# Altium schematic sheet IO Systems.SchDoc: INPUT / OUTPUT SYSTEMS
size A2; DrawnBy: Avishka Herath; DocumentNumber: 1; Revision: 1.4; SheetNumber: 1; SheetTotal: 2; Project: Coco V2.0 PCB
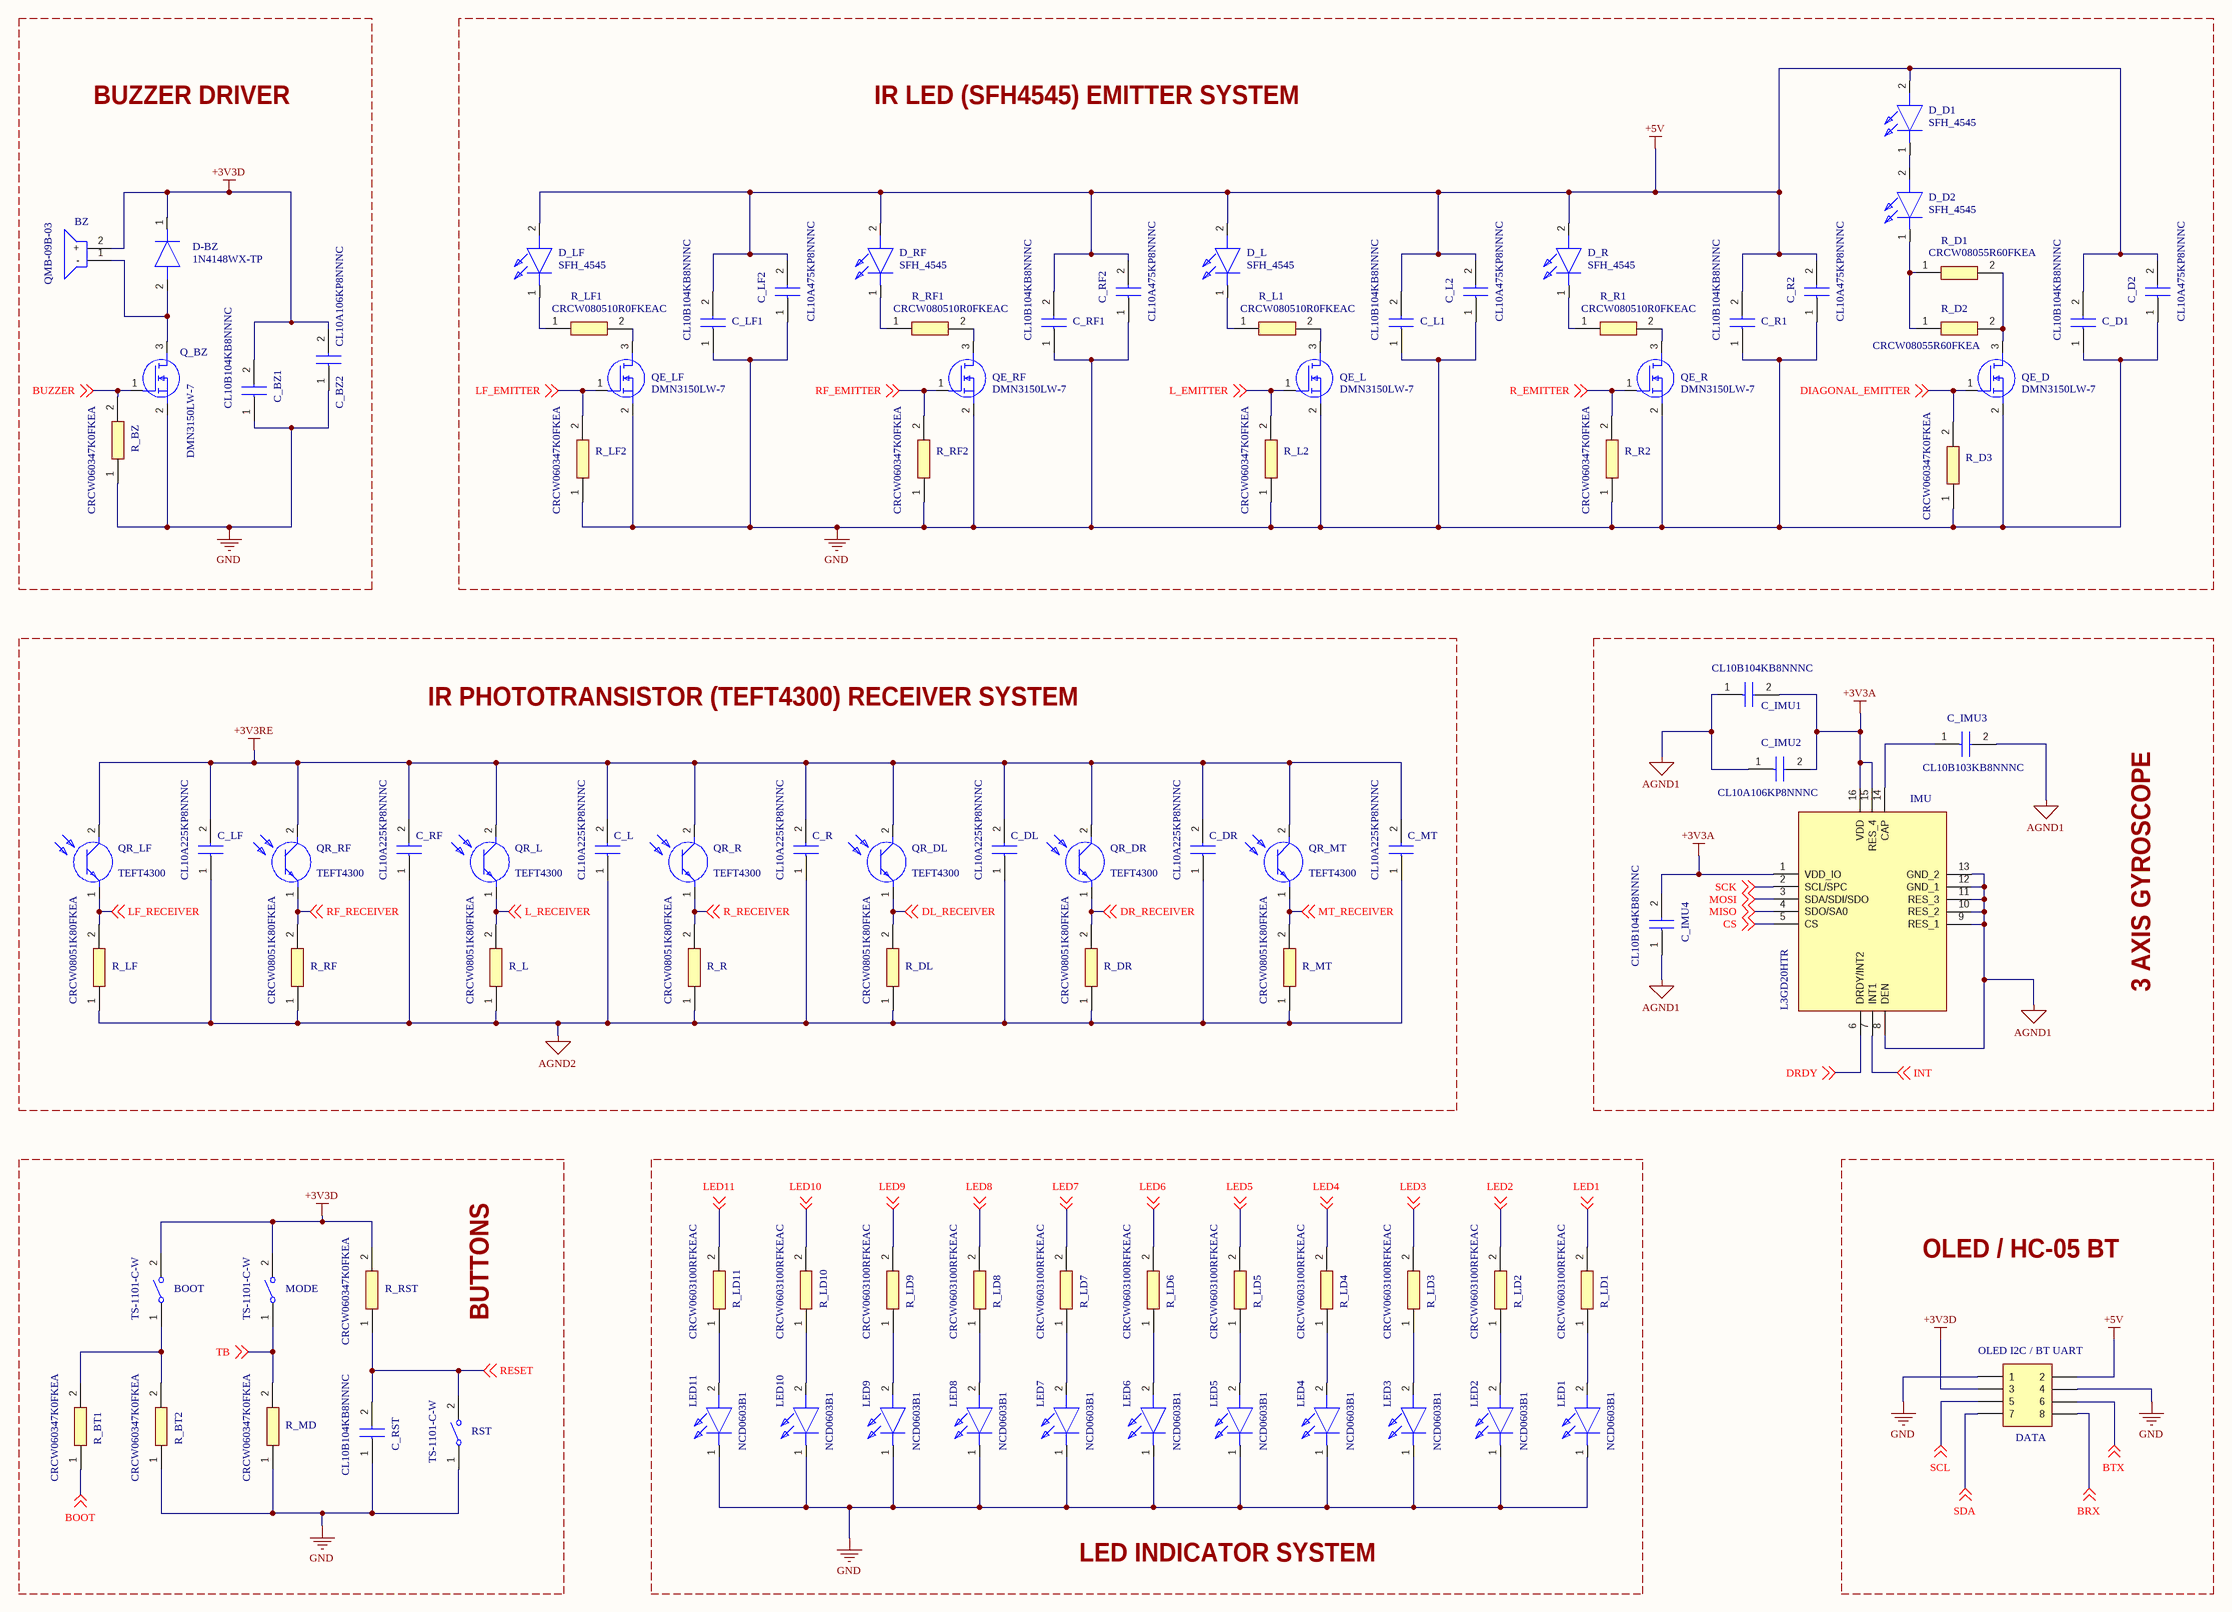
[diagram p0: IO Systems.SchDoc]

## Parts
BOOT  TS-1101-C-W  [TECO-FSMSM-2_V]
BZ  QMB-09B-03  [CST931AP]
C_BZ1  CL10B104KB8NNNC  [CAPC1608X90N]
C_BZ2  CL10A106KP8NNNC  [CAPC1608X90N]
C_D1  CL10B104KB8NNNC  [CAPC1608X90N]
C_D2  CL10A475KP8NNNC  [CAPC1608X90N]
C_DL  CL10A225KP8NNNC  [CAPC1608X90N]
C_DR  CL10A225KP8NNNC  [CAPC1608X90N]
C_IMU1  CL10B104KB8NNNC  [CAPC1608X90N]
C_IMU2  CL10A106KP8NNNC  [CAPC1608X90N]
C_IMU3  CL10B103KB8NNNC  [CAPC1608X90N]
C_IMU4  CL10B104KB8NNNC  [CAPC1608X90N]
C_L  CL10A225KP8NNNC  [CAPC1608X90N]
C_L1  CL10B104KB8NNNC  [CAPC1608X90N]
C_L2  CL10A475KP8NNNC  [CAPC1608X90N]
C_LF  CL10A225KP8NNNC  [CAPC1608X90N]
C_LF1  CL10B104KB8NNNC  [CAPC1608X90N]
C_LF2  CL10A475KP8NNNC  [CAPC1608X90N]
C_MT  CL10A225KP8NNNC  [CAPC1608X90N]
C_R  CL10A225KP8NNNC  [CAPC1608X90N]
C_R1  CL10B104KB8NNNC  [CAPC1608X90N]
C_R2  CL10A475KP8NNNC  [CAPC1608X90N]
C_RF  CL10A225KP8NNNC  [CAPC1608X90N]
C_RF1  CL10B104KB8NNNC  [CAPC1608X90N]
C_RF2  CL10A475KP8NNNC  [CAPC1608X90N]
C_RST  CL10B104KB8NNNC  [CAPC1608X90N]
D-BZ  1N4148WX-TP  [SOD2512X115N]
D_D1  SFH_4545  [SFH4545]
D_D2  SFH_4545  [SFH4545]
D_L  SFH_4545  [SFH4545]
D_LF  SFH_4545  [SFH4545]
D_R  SFH_4545  [SFH4545]
D_RF  SFH_4545  [SFH4545]
DATA  OLED I2C / BT UART  [MY_FE04-2]
IMU  L3GD20HTR  [H3LIS100DLTR]
LED1  NCD0603B1  [LEDC1608X40N]
LED2  NCD0603B1  [LEDC1608X40N]
LED3  NCD0603B1  [LEDC1608X40N]
LED4  NCD0603B1  [LEDC1608X40N]
LED5  NCD0603B1  [LEDC1608X40N]
LED6  NCD0603B1  [LEDC1608X40N]
LED7  NCD0603B1  [LEDC1608X40N]
LED8  NCD0603B1  [LEDC1608X40N]
LED9  NCD0603B1  [LEDC1608X40N]
LED10  NCD0603B1  [LEDC1608X40N]
LED11  NCD0603B1  [LEDC1608X40N]
MODE  TS-1101-C-W  [TECO-FSMSM-2_V]
Q_BZ  DMN3150LW-7  [SOT65P210X110-3N]
QE_D  DMN3150LW-7  [SOT65P210X110-3N]
QE_L  DMN3150LW-7  [SOT65P210X110-3N]
QE_LF  DMN3150LW-7  [SOT65P210X110-3N]
QE_R  DMN3150LW-7  [SOT65P210X110-3N]
QE_RF  DMN3150LW-7  [SOT65P210X110-3N]
QR_DL  TEFT4300  [TEFT4300]
QR_DR  TEFT4300  [TEFT4300]
QR_L  TEFT4300  [TEFT4300]
QR_LF  TEFT4300  [TEFT4300]
QR_MT  TEFT4300  [TEFT4300]
QR_R  TEFT4300  [TEFT4300]
QR_RF  TEFT4300  [TEFT4300]
R_BT1  CRCW060347K0FKEA  [RESC1608X50N]
R_BT2  CRCW060347K0FKEA  [RESC1608X50N]
R_BZ  CRCW060347K0FKEA  [RESC1608X50N]
R_D1  CRCW08055R60FKEA  [RESC2012X60N]
R_D2  CRCW08055R60FKEA  [RESC2012X60N]
R_D3  CRCW060347K0FKEA  [RESC1608X50N]
R_DL  CRCW08051K80FKEA  [RESC2012X60N]
R_DR  CRCW08051K80FKEA  [RESC2012X60N]
R_L  CRCW08051K80FKEA  [RESC2012X60N]
R_L1  CRCW080510R0FKEAC  [RESC2012X60N]
R_L2  CRCW060347K0FKEA  [RESC1608X50N]
R_LD1  CRCW0603100RFKEAC  [RESC1608X55N]
R_LD2  CRCW0603100RFKEAC  [RESC1608X55N]
R_LD3  CRCW0603100RFKEAC  [RESC1608X55N]
R_LD4  CRCW0603100RFKEAC  [RESC1608X55N]
R_LD5  CRCW0603100RFKEAC  [RESC1608X55N]
R_LD6  CRCW0603100RFKEAC  [RESC1608X55N]
R_LD7  CRCW0603100RFKEAC  [RESC1608X55N]
R_LD8  CRCW0603100RFKEAC  [RESC1608X55N]
R_LD9  CRCW0603100RFKEAC  [RESC1608X55N]
R_LD10  CRCW0603100RFKEAC  [RESC1608X55N]
R_LD11  CRCW0603100RFKEAC  [RESC1608X55N]
R_LF  CRCW08051K80FKEA  [RESC2012X60N]
R_LF1  CRCW080510R0FKEAC  [RESC2012X60N]
R_LF2  CRCW060347K0FKEA  [RESC1608X50N]
R_MD  CRCW060347K0FKEA  [RESC1608X50N]
R_MT  CRCW08051K80FKEA  [RESC2012X60N]
R_R  CRCW08051K80FKEA  [RESC2012X60N]
R_R1  CRCW080510R0FKEAC  [RESC2012X60N]
R_R2  CRCW060347K0FKEA  [RESC1608X50N]
R_RF  CRCW08051K80FKEA  [RESC2012X60N]
R_RF1  CRCW080510R0FKEAC  [RESC2012X60N]
R_RF2  CRCW060347K0FKEA  [RESC1608X50N]
R_RST  CRCW060347K0FKEA  [RESC1608X50N]
RST  TS-1101-C-W  [TECO-FSMSM-2_V]

## Blocks framed on the sheet
BUZZER DRIVER: BZ C_BZ1 C_BZ2 D-BZ Q_BZ R_BZ
IR LED (SFH4545) EMITTER SYSTEM: C_D1 C_D2 C_L1 C_L2 C_LF1 C_LF2 C_R1 C_R2 C_RF1 C_RF2 D_D1 D_D2 D_L D_LF D_R D_RF QE_D QE_L QE_LF QE_R QE_RF R_D1-R_D3 R_L1 R_L2 R_LF1 R_LF2 R_R1 R_R2 R_RF1 R_RF2
IR PHOTOTRANSISTOR (TEFT4300) RECEIVER SYSTEM: C_DL C_DR C_L C_LF C_MT C_R C_RF QR_DL QR_DR QR_L QR_LF QR_MT QR_R QR_RF R_DL R_DR R_L R_LF R_MT R_R R_RF
3 AXIS GYROSCOPE: C_IMU1-C_IMU4 IMU
BUTTONS: BOOT C_RST MODE R_BT1 R_BT2 R_MD R_RST RST
LED INDICATOR SYSTEM: LED1-LED11 R_LD1-R_LD11
OLED / HC-05 BT: DATA

## Nets
+3V3A: C_IMU1.2 C_IMU2.2 C_IMU4.2 IMU.1(VDD_IO) IMU.15(RES_4) IMU.16(VDD)
+3V3D: BOOT.2 BZ.2(+) C_BZ1.2 C_BZ2.2 D-BZ.1(K) DATA.3 MODE.2 R_RST.2
+3V3RE: C_DL.2 C_DR.2 C_L.2 C_LF.2 C_MT.2 C_R.2 C_RF.2 QR_DL.2(C) QR_DR.2(C) QR_L.2(C) QR_LF.2(C) QR_MT.2(C) QR_R.2(C) QR_RF.2(C)
+5V: C_D1.2 C_D2.2 C_L1.2 C_L2.2 C_LF1.2 C_LF2.2 C_R1.2 C_R2.2 C_RF1.2 C_RF2.2 D_D1.2(A) D_L.2(A) D_LF.2(A) D_R.2(A) D_RF.2(A) DATA.2
AGND1: C_IMU1.1 C_IMU2.1 C_IMU3.2 C_IMU4.1 IMU.8(DEN) IMU.9(RES_1) IMU.10(RES_2) IMU.11(RES_3) IMU.12(GND_1) IMU.13(GND_2)
AGND2: C_DL.1 C_DR.1 C_L.1 C_LF.1 C_MT.1 C_R.1 C_RF.1 R_DL.1 R_DR.1 R_L.1 R_LF.1 R_MT.1 R_R.1 R_RF.1
GND: C_BZ1.1 C_BZ2.1 C_D1.1 C_D2.1 C_L1.1 C_L2.1 C_LF1.1 C_LF2.1 C_R1.1 C_R2.1 C_RF1.1 C_RF2.1 C_RST.1 DATA.1 DATA.4 LED1.1(K) LED2.1(K) LED3.1(K) LED4.1(K) LED5.1(K) LED6.1(K) LED7.1(K) LED8.1(K) LED9.1(K) LED10.1(K) LED11.1(K) Q_BZ.2(S) QE_D.2(S) QE_L.2(S) QE_LF.2(S) QE_R.2(S) QE_RF.2(S) R_BT2.1 R_BZ.1 R_D3.1 R_L2.1 R_LF2.1 R_MD.1 R_R2.1 R_RF2.1 RST.1
BOOT: R_BT1.1 ; off-sheet BOOT
BRX: DATA.8 ; off-sheet BRX
BTX: DATA.6 ; off-sheet BTX
BUZZER: Q_BZ.1(G) R_BZ.2 ; off-sheet BUZZER
CS: IMU.5(CS) ; off-sheet CS
DIAGONAL_EMITTER: QE_D.1(G) R_D3.2 ; off-sheet DIAGONAL_EMITTER
DL_RECEIVER: QR_DL.1(E) R_DL.2 ; off-sheet DL_RECEIVER
DR_RECEIVER: QR_DR.1(E) R_DR.2 ; off-sheet DR_RECEIVER
DRDY: IMU.6(DRDY/INT2) ; off-sheet DRDY
INT: IMU.7(INT1) ; off-sheet INT
L_EMITTER: QE_L.1(G) R_L2.2 ; off-sheet L_EMITTER
L_RECEIVER: QR_L.1(E) R_L.2 ; off-sheet L_RECEIVER
LED1: R_LD1.2 ; off-sheet LED1
LED2: R_LD2.2 ; off-sheet LED2
LED3: R_LD3.2 ; off-sheet LED3
LED4: R_LD4.2 ; off-sheet LED4
LED5: R_LD5.2 ; off-sheet LED5
LED6: R_LD6.2 ; off-sheet LED6
LED7: R_LD7.2 ; off-sheet LED7
LED8: R_LD8.2 ; off-sheet LED8
LED9: R_LD9.2 ; off-sheet LED9
LED10: R_LD10.2 ; off-sheet LED10
LED11: R_LD11.2 ; off-sheet LED11
LF_EMITTER: QE_LF.1(G) R_LF2.2 ; off-sheet LF_EMITTER
LF_RECEIVER: QR_LF.1(E) R_LF.2 ; off-sheet LF_RECEIVER
MISO: IMU.4(SDO/SA0) ; off-sheet MISO
MOSI: IMU.3(SDA/SDI/SDO) ; off-sheet MOSI
MT_RECEIVER: QR_MT.1(E) R_MT.2 ; off-sheet MT_RECEIVER
R_EMITTER: QE_R.1(G) R_R2.2 ; off-sheet R_EMITTER
R_RECEIVER: QR_R.1(E) R_R.2 ; off-sheet R_RECEIVER
RESET: C_RST.2 R_RST.1 RST.2 ; off-sheet RESET
RF_EMITTER: QE_RF.1(G) R_RF2.2 ; off-sheet RF_EMITTER
RF_RECEIVER: QR_RF.1(E) R_RF.2 ; off-sheet RF_RECEIVER
SCK: IMU.2(SCL/SPC) ; off-sheet SCK
SCL: DATA.5 ; off-sheet SCL
SDA: DATA.7 ; off-sheet SDA
TB: MODE.1 R_MD.2 ; off-sheet TB
NetBOOT_1: BOOT.1 R_BT1.2 R_BT2.2
NetBZ_1: BZ.1(-) D-BZ.2(A) Q_BZ.3(D)
NetC_IMU3_1: C_IMU3.1 IMU.14(CAP)
NetD_D1_1: D_D1.1(K) D_D2.2(A)
NetD_D2_1: D_D2.1(K) R_D1.1 R_D2.1
NetD_L_1: D_L.1(K) R_L1.1
NetD_LF_1: D_LF.1(K) R_LF1.1
NetD_R_1: D_R.1(K) R_R1.1
NetD_RF_1: D_RF.1(K) R_RF1.1
NetLED1_2: LED1.2(A) R_LD1.1
NetLED2_2: LED2.2(A) R_LD2.1
NetLED3_2: LED3.2(A) R_LD3.1
NetLED4_2: LED4.2(A) R_LD4.1
NetLED5_2: LED5.2(A) R_LD5.1
NetLED6_2: LED6.2(A) R_LD6.1
NetLED7_2: LED7.2(A) R_LD7.1
NetLED8_2: LED8.2(A) R_LD8.1
NetLED9_2: LED9.2(A) R_LD9.1
NetLED10_2: LED10.2(A) R_LD10.1
NetLED11_2: LED11.2(A) R_LD11.1
NetQE_D_3: QE_D.3(D) R_D1.2 R_D2.2
NetQE_L_3: QE_L.3(D) R_L1.2
NetQE_LF_3: QE_LF.3(D) R_LF1.2
NetQE_R_3: QE_R.3(D) R_R1.2
NetQE_RF_3: QE_RF.3(D) R_RF1.2

## Notes on the sheet
- Title:
- Size:
- Date:
- Project:
- A2
- Document Number:
- Drawn By:
- Sheet
- Revision:
- of

## Library data of the parts
BOOT MODE RST = CMP-2000-07511-1: None Without 50mA 6mm 50,000 Times 260gf 12V 3.6mm 2.5mm Rectangle button Standing paste SPST SMD Tactile Switches ROHS; Manufacturer: TE Connectivity; Actuator Length: 1.07mm; Electrical Life: 20000Cycles; Actuator Material: Polyamide; Illumination Type: Illuminated; Voltage Rating (DC): 24V; Contact Resistance: 100mOhm; Case\/Package: SMD/SMT; Operating Force: 180gf; Switch Travel: 0.25mm; Packaging: LoosePiece; Max Operating Temperature: 85degC; ELV: Compliant; Package Description: 2-Pin Surface Mount Device, Body 6 x 3.5 mm, Pitch 9.19 mm; RoHSCompliant: true; Manufacturer URL: http://www.te.com/; Contact Plating: Silver; Contact Material: Brass; Mounting Technology: SurfaceMount; Current Rating: 50mA; Contact Current Rating: 50mA; Datasheet Version: Rev. C2, 08/2014; Datasheet URL: http://www.te.com/commerce/DocumentDelivery/DDEController?Action=showdoc&DocId=Customer+Drawing%7F1437566-3%7FC2%7Fpdf%7FEnglish%7FENG_CD_1437566-3_C2_1437566_3_1_c.dwg.pdf%7F1437566-3; Mechanical Life: 20000Cycles; Package Reference: FSMSM; REACH SVHC: Unknown; Orientation: Straight; Min Operating Temperature: -35degC; Lead Free: LeadFree; Max Voltage Rating (DC): 12V; Termination: GullWing; Package Quantity: 1000; Mount: SurfaceMount; Throw Configuration: SPST
BZ = CST-931AP: 85dB Passive (external drive) Electromagnetic Type 2.7kHz Plugin,D=9mm Buzzers ROHS; Manufacturer_Name: CUI Devices; Datasheet Link: https://www.cui.com/product/resource/cst-931ap.pdf; Height: 5mm; Manufacturer_Part_Number: CST-931AP; Mouser Part Number: 490-CST-931AP; Mouser Price/Stock: https://www.mouser.co.uk/ProductDetail/CUI-Devices/CST-931AP?qs=WyjlAZoYn50QTlAUyWPZCA%3D%3D; Arrow Part Number: CST-931AP; Arrow Price/Stock: https://www.arrow.com/en/products/cst-931ap/cui-inc
C_BZ1 C_D1 C_IMU1 C_IMU4 C_L1 C_LF1 C_R1 C_RF1 C_RST = CL10B104KB8NNNC: Capacitor; Manufacturer_Name: SAMSUNG; Datasheet Link: https://datasheet.datasheetarchive.com/originals/distributors/Datasheets-DGA10/2408969.pdf; Height: 0.9mm; Manufacturer_Part_Number: CL10B104KB8NNNC; Mouser Part Number: 187-CL10B104KB8NNNC; Mouser Price/Stock: https://www.mouser.co.uk/ProductDetail/Samsung-Electro-Mechanics/CL10B104KB8NNNC?qs=349EhDEZ59rvGc2rLwVOdA%3D%3D; Arrow Part Number: CL10B104KB8NNNC; Arrow Price/Stock: https://www.arrow.com/en/products/cl10b104kb8nnnc/samsung-electro-mechanics?region=nac
C_BZ2 C_IMU2 = CL10A106KP8NNNC: Capacitor; Manufacturer_Name: SAMSUNG; Datasheet Link: https://datasheet.datasheetarchive.com/originals/distributors/Datasheets-DGA10/2415998.pdf; Height: 0.9mm; Manufacturer_Part_Number: CL10A106KP8NNNC; Mouser Part Number: 187-CL10A106KP8NNNC; Mouser Price/Stock: https://www.mouser.co.uk/ProductDetail/Samsung-Electro-Mechanics/CL10A106KP8NNNC?qs=X6jEic%2FHinAlyfRHj7fKwg%3D%3D; Arrow Part Number: CL10A106KP8NNNC; Arrow Price/Stock: https://www.arrow.com/en/products/cl10a106kp8nnnc/samsung-electro-mechanics?region=europe
C_D2 C_L2 C_LF2 C_R2 C_RF2 = CL10A475KP8NNNC: Capacitor; Manufacturer_Name: SAMSUNG; Datasheet Link: https://www.arrow.com/en/products/cl10a475kp8nnnc/samsung-electro-mechanics; Height: 0.9mm; Manufacturer_Part_Number: CL10A475KP8NNNC; Mouser Part Number: 187-CL10A475KP8NNNC; Mouser Price/Stock: https://www.mouser.co.uk/ProductDetail/Samsung-Electro-Mechanics/CL10A475KP8NNNC?qs=hqM3L16%252BxlfQRmkWsZz5vA%3D%3D; Arrow Part Number: CL10A475KP8NNNC; Arrow Price/Stock: https://www.arrow.com/en/products/cl10a475kp8nnnc/samsung-electro-mechanics?region=europe
C_DL C_DR C_L C_LF C_MT C_R C_RF = CL10A225KP8NNNC: Capacitor; Manufacturer_Name: SAMSUNG; Datasheet Link: https://datasheet.datasheetarchive.com/originals/distributors/Datasheets-DGA10/2411103.pdf; Height: 0.9mm; Manufacturer_Part_Number: CL10A225KP8NNNC; Mouser Part Number: 187-CL10A225KP8NNNC; Mouser Price/Stock: https://www.mouser.co.uk/ProductDetail/Samsung-Electro-Mechanics/CL10A225KP8NNNC?qs=hqM3L16%252Bxldb5UYUGQVB5Q%3D%3D; Arrow Part Number: CL10A225KP8NNNC; Arrow Price/Stock: https://www.arrow.com/en/products/cl10a225kp8nnnc/samsung-electro-mechanics?region=europe
C_IMU3 = CL10B103KB8NNNC: Capacitor; Manufacturer_Name: SAMSUNG; Datasheet Link: https://datasheet.datasheetarchive.com/originals/distributors/Datasheets_SAMA/f3f01ceab90a863c6d6e9eba92d45bd3.pdf; Height: 0.9mm; Manufacturer_Part_Number: CL10B103KB8NNNC; Mouser Part Number: 187-CL10B103KB8NNNC; Mouser Price/Stock: https://www.mouser.co.uk/ProductDetail/Samsung-Electro-Mechanics/CL10B103KB8NNNC?qs=349EhDEZ59pAsZxZjVI0UQ%3D%3D; Arrow Part Number: CL10B103KB8NNNC; Arrow Price/Stock: https://www.arrow.com/en/products/cl10b103kb8nnnc/samsung-electro-mechanics?region=nac
D-BZ = 1N4148WX-TP: Diode; Manufacturer_Name: MCC; Datasheet Link: https://www.mccsemi.com/pdf/Products/1N4148WX(SOD-323).pdf; Height: 1.15mm; Manufacturer_Part_Number: 1N4148WX-TP; Mouser Part Number: 833-1N4148WX-TP; Mouser Price/Stock: https://www.mouser.co.uk/ProductDetail/Micro-Commercial-Components-MCC/1N4148WX-TP?qs=Vo7e0yZOYdH7fKyVBspYOg%3D%3D; Arrow Part Number: 1N4148WX-TP; Arrow Price/Stock: https://www.arrow.com/en/products/1n4148wx-tp/micro-commercial-components?region=nac
D_D1 D_D2 D_L D_LF D_R D_RF = SFH_4545: LED; Manufacturer_Name: ams OSRAM; Datasheet Link: https://datasheet.datasheetarchive.com/originals/distributors/DKDS41/DSANUWW0036915.pdf; Height: 8.3mm; Manufacturer_Part_Number: SFH 4545; Mouser Part Number: 720-SFH4545; Mouser Price/Stock: https://www.mouser.co.uk/ProductDetail/ams-OSRAM/SFH-4545?qs=VcOkZLzzaubOJpq6Xyji1A%3D%3D; Arrow Part Number: SFH 4545; Arrow Price/Stock: https://www.arrow.com/en/products/sfh4545/osram-opto-semiconductors
DATA = Header 4X2: Header, 8-Pin, Dual row; ASiD Part Number: Header 4X2-AS
IMU = L3GD20HTR: Integrated Circuit; Manufacturer_Name: STMicroelectronics; Datasheet Link: http://www.st.com/content/ccc/resource/technical/document/datasheet/35/b1/e0/39/71/57/43/01/DM00060659.pdf/files/DM00060659.pdf/jcr:content/translations/en.DM00060659.pdf; Height: 1mm; Manufacturer_Part_Number: L3GD20HTR; Mouser Part Number: 511-L3GD20HTR; Mouser Price/Stock: https://www.mouser.co.uk/ProductDetail/STMicroelectronics/L3GD20HTR?qs=7v3IMFVTeKNoM%2F2Sb4QSlQ%3D%3D; Arrow Part Number: L3GD20HTR; Arrow Price/Stock: https://www.arrow.com/en/products/l3gd20htr/stmicroelectronics?region=nac
LED1-LED11 = LB_Q39E-L2OO-35-1: 20mA Colorless transparent lens 80mcd~220mcd 463nm~475nm -30℃~+85℃ Blue 130° 72mW 2.6V~3.6V 0603 LED Indication - Discrete ROHS; Manufacturer_Name: ams OSRAM; Manufacturer_Part_Number: LB Q39E-L2OO-35-1; Datasheet Link: https://componentsearchengine.com/Datasheets/1/LBQ39E-L2OO-35-1.pdf; Height: 0.4mm; Mouser Part Number: 720-LBQ39EL2N2351; Mouser Price/Stock: https://www.mouser.co.uk/ProductDetail/OSRAM-Opto-Semiconductors/LB-Q39E-L2OO-35-1?qs=74fRo9GAWsz%2FeNvglIOl1w%3D%3D; Arrow Part Number: LB Q39E-L2OO-35-1; Arrow Price/Stock: https://www.arrow.com/en/products/lbq39e-l2oo-35-1/osram-opto-semiconductors
Q_BZ QE_D QE_L QE_LF QE_R QE_RF = DMN3150LW-7: MOSFET (N-Channel); Manufacturer_Name: Diodes Incorporated; Datasheet Link: https://www.diodes.com/assets/Datasheets/ds31514.pdf; Height: 1.1mm; Manufacturer_Part_Number: DMN3150LW-7; Mouser Part Number: 621-DMN3150LW-7; Mouser Price/Stock: https://www.mouser.co.uk/ProductDetail/Diodes-Incorporated/DMN3150LW-7?qs=ptj1V1atRAqvGijpY%2FDU4Q%3D%3D; Arrow Part Number: DMN3150LW-7; Arrow Price/Stock: https://www.arrow.com/en/products/dmn3150lw-7/diodes-incorporated
QR_DL QR_DR QR_L QR_LF QR_MT QR_R QR_RF = TEFT4300: Phototransistor; Manufacturer_Name: Vishay; Datasheet Link: https://datasheet.datasheetarchive.com/originals/distributors/Datasheets-310/86913.pdf; Height: 6.1mm; Manufacturer_Part_Number: TEFT4300; Mouser Part Number: 782-TEFT4300; Mouser Price/Stock: https://www.mouser.co.uk/ProductDetail/Vishay-Semiconductors/TEFT4300?qs=HsFHTXumnCRbcrt8oPFPMA%3D%3D; Arrow Part Number: TEFT4300; Arrow Price/Stock: https://www.arrow.com/en/products/teft4300/vishay?region=nac
R_BT1 R_BT2 R_BZ R_D3 R_L2 R_LF2 R_MD R_R2 R_RF2 R_RST = CRCW060347K0FKEA: Resistor; Manufacturer_Name: Vishay; Datasheet Link: http://www.vishay.com/docs/20035/dcrcwe3.pdf; Height: 0.5mm; Manufacturer_Part_Number: CRCW060347K0FKEA; Mouser Part Number: 71-CRCW0603-47K-E3; Mouser Price/Stock: https://www.mouser.co.uk/ProductDetail/Vishay-Dale/CRCW060347K0FKEA?qs=yJVtgANCw03gcaACf6JZKA%3D%3D; Arrow Part Number: CRCW060347K0FKEA; Arrow Price/Stock: https://www.arrow.com/en/products/crcw060347k0fkea/vishay?region=nac
R_D1 R_D2 = CRCW08055R60FKEAHP: Resistor; Manufacturer_Name: Vishay; Datasheet Link: https://componentsearchengine.com/Datasheets/1/CRCW08051R00FKEAHP.pdf; Height: 0.6mm; Manufacturer_Part_Number: CRCW08055R60FKEAHP; Mouser Part Number: 71-CRCW08055R60FKEAH; Mouser Price/Stock: https://www.mouser.co.uk/ProductDetail/Vishay-Dale/CRCW08055R60FKEAHP?qs=40TFAHZMFve7x%252BtJvdQU6Q%3D%3D
R_DL R_DR R_L R_LF R_MT R_R R_RF = CRCW08051K80FKEAC: Resistor; Manufacturer_Name: Vishay; Datasheet Link: https://g.componentsearchengine.com/Datasheets/1/CRCW08051K30FKEAC.pdf; Height: 0.6mm; Manufacturer_Part_Number: CRCW08051K80FKEAC; Mouser Part Number: 71-CRCW08051K80FKEAC; Mouser Price/Stock: https://www.mouser.co.uk/ProductDetail/Vishay-Dale/CRCW08051K80FKEAC?qs=E3Y5ESvWgWN24%2FavPduZ0A%3D%3D; Arrow Part Number: CRCW08051K80FKEAC; Arrow Price/Stock: https://www.arrow.com/en/products/crcw08051k80fkeac/vishay
R_L1 R_LF1 R_R1 R_RF1 = CRCW080510R0FKEAC: Resistor; Manufacturer_Name: Vishay; Datasheet Link: https://www.arrow.com/en/products/crcw080510r0fkeac/vishay; Height: 0.6mm; Manufacturer_Part_Number: CRCW080510R0FKEAC; Mouser Part Number: 71-CRCW080510R0FKEAC; Mouser Price/Stock: https://www.mouser.co.uk/ProductDetail/Vishay-Dale/CRCW080510R0FKEAC?qs=E3Y5ESvWgWM6RDjxtLx2og%3D%3D; Arrow Part Number: CRCW080510R0FKEAC; Arrow Price/Stock: https://www.arrow.com/en/products/crcw080510r0fkeac/vishay?region=nac
R_LD1-R_LD11 = CRCW0603100RFKEAC: Resistor; Manufacturer_Name: Vishay; Datasheet Link: https://componentsearchengine.com/Datasheets/1/CRCW0603100RFKEAC.pdf; Height: 0.55mm; Manufacturer_Part_Number: CRCW0603100RFKEAC; Mouser Part Number: 71-CRCW0603100RFKEAC; Mouser Price/Stock: https://www.mouser.co.uk/ProductDetail/Vishay-Dale/CRCW0603100RFKEAC?qs=E3Y5ESvWgWPJqb4%2F19sAKw%3D%3D; Arrow Part Number: CRCW0603100RFKEAC; Arrow Price/Stock: https://www.arrow.com/en/products/crcw0603100rfkeac/vishay?utm_currency=USD&region=nac